# Altium schematic sheet TPS630250RNCT Buck-Boost Switching Regulator.SchDoc: +3.3 Output DC-DC Converter
size A4
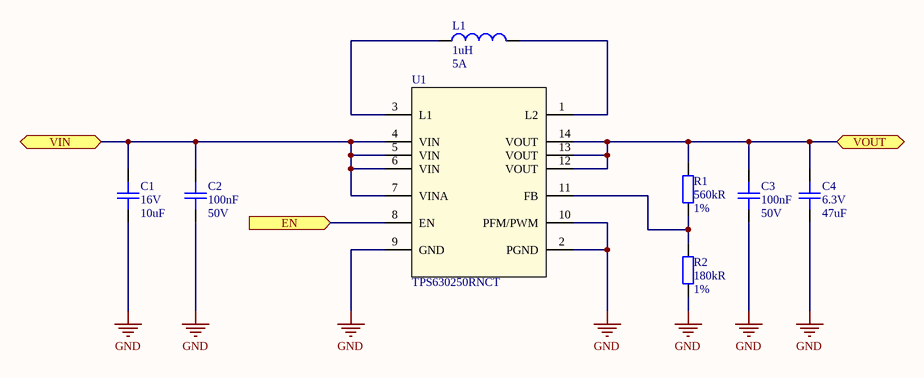
[diagram p0: TPS630250RNCT Buck-Boost Switching Regulator.SchDoc]

## Parts
C1  Voltage Rating: 16V  Capacitance: 10uF  [C0603]  (hidden comment: CAP CER 10UF 16V X5R 0603)
C2  Capacitance: 100nF  Voltage: 50V  [C0402]  (hidden comment: CAP CER 0.1UF 50V X7R 0402)
C3  Capacitance: 100nF  Voltage: 50V  [C0402]  (hidden comment: CAP CER 0.1UF 50V X7R 0402)
C4  Voltage Rating: 6.3V  Capacitance: 47uF  [C0603]  (hidden comment: CAP CER 47UF 6.3V X5R 0603)
L1  Inductance: 1uH  Current Rating: 5A  [IND_IHLP-1212B00]  (hidden comment: FIXED IND 1UH 5A 24 MOHM SMD)
R1  Resistance: 560kR  Tolerance: 1%  [R0402]  (hidden comment: RES SMD 560K OHM 1% 1/16W 0402)
R2  Resistance: 180kR  Tolerance: 1%  [R0402]  (hidden comment: RES SMD 180K OHM 1% 1/16W 0402)
U1  TPS630250RNCT  [VFQFN-14]

## Ports
EN (in), VIN, VOUT

## Nets
GND: C1.1 C2.1 C3.1 C4.1 R2.1 U1.2(PGND) U1.9(GND) U1.10(PFM/PWM)
EN: U1.8(EN) ; port EN
VIN: C1.2 C2.2 U1.4(VIN) U1.5(VIN) U1.6(VIN) U1.7(VINA) ; port VIN
VOUT: C3.2 C4.2 R1.2 U1.12(VOUT) U1.13(VOUT) U1.14(VOUT) ; port VOUT
NetL1_1: L1.1 U1.3(L1)
NetL1_2: L1.2 U1.1(L2)
NetR1_1: R1.1 R2.2 U1.11(FB)

## Notes on the sheet
- Title
- Size:
- Date:
- A4
- Number:
- Time:
- Revision:
- Sheet
- of
- File:

## Library data of the parts
C1 = CAP CER 10UF 16V X5R 0603: 10µF ±10% 16V Ceramic Capacitor X5R 0603 (1608 Metric); Manufacturer: Murata; Manufacturer Part Number: GRM188R61C106KAALJ; Supplier 1: Digi-Key; Stock 1: 5470; Pricing 1: 1=0.39, 10=0.271, 100=0.1628, 500=0.1221, 1000=0.1031, 2500=0.0977, 5000=0.0923 (USD); Mount: Surface Mount; Case Code (Imperial): 0603; Case Code (Metric): 1608; Min Operating Temperature: -55°C; Max Operating Temperature: 85°C; Voltage Rating (DC): 16V; Tolerance: 10%; Packaging: Tape and Reel; Package Quantity: 10000; Dielectric: X5R; Termination: SMD/SMT; Composition: Ceramic; Length: 0.063inch; Height: 0.8mm; Width: 0.031inch; Thickness: 0.037inch; Supplier Part Number 1: 490-12736-1-ND; Case/Package: 0603; Weight: 0.000222oz
C2 C3 = CAP CER 0.1UF 50V X7R 0402: 0.1µF ±10% 50V Ceramic Capacitor X7R 0402 (1005 Metric); Manufacturer: TDK; Manufacturer Part Number: CGA2B3X7R1H104K050BB; Supplier 1: Digi-Key; Stock 1: 2925303; Pricing 1: 1=0.17, 10=0.118, 50=0.0668, 100=0.0553, 500=0.0388, 1000=0.0321, 2500=0.0299, 5000=0.0273 (USD); Mount: Surface Mount; Case/Package: 0402; Weight: 2.3E-05oz; Case Code (Metric): 1005; Case Code (Imperial): 0402; Min Operating Temperature: -55°C; Max Operating Temperature: 125°C; Voltage Rating: 50V; Tolerance: 10%; Packaging: Tape and Reel; Package Quantity: 1; Voltage Rating (DC): 50V; Dielectric: X7R; Termination: SMD/SMT; Composition: Ceramic; Length: 1mm; Height: 0.5mm; Width: 0.02inch; Thickness: 0.022inch; Depth: 0.5mm; Ratings: AEC-Q200; REACH SVHC: No SVHC; Lead Free: Lead Free; ComponentLink1URL: http://product.tdk.com/capacitor/mlcc/en/documents/mlccspec_automotive_general_midvoltage_en.pdf?src-supplier=Future+Electronics; ComponentLink1Description: http://product.tdk.com/capacitor/mlcc/en/documents/mlccspec_automotive_general_midvoltage_en.pdf?src-supplier=Future+Electronics; ComponentLink2URL: http://www.farnell.com/datasheets/1807242.pdf?src-supplier=Element14; ComponentLink2Description: http://www.farnell.com/datasheets/1807242.pdf?src-supplier=Element14; ComponentLink3URL: http://www.mouser.com/ds/2/400/lcc_automotive_general_en-843974.pdf?src-supplier=Mouser; ComponentLink3Description: http://www.mouser.com/ds/2/400/lcc_automotive_general_en-843974.pdf?src-supplier=Mouser; ComponentLink4URL: http://www.farnell.com/datasheets/1936565.pdf?src-supplier=Element14; ComponentLink4Description: http://www.farnell.com/datasheets/1936565.pdf?src-supplier=Element14; ComponentLink5URL: http://www.farnell.com/datasheets/1735392.pdf?src-supplier=Element14; ComponentLink5Description: http://www.farnell.com/datasheets/1735392.pdf?src-supplier=Element14; Supplier Part Number 1: 445-6899-1-ND
C4 = CAP CER 47UF 6.3V X5R 0603: 47 µF ±20% 6.3V Ceramic Capacitor X5R 0603 (1608 Metric); Manufacturer: AVX Corporation; Manufacturer Part Number: 06036D476MAT2A; Supplier 1: Digi-Key; Stock 1: 325858; Pricing 1: 1=0.26, 10=0.18, 100=0.102, 500=0.072, 1000=0.063 (USD); Mount: Surface Mount; Case Code (Imperial): 0603; Case Code (Metric): 1608; Min Operating Temperature: -55°C; Max Operating Temperature: 85°C; Voltage Rating (DC): 6.3V; Tolerance: 20%; Packaging: Tape and Reel; Package Quantity: 1; Dielectric: X5R; Termination: SMD/SMT; Composition: Ceramic; Length: 1.6mm; Height: 0.8mm; Width: 0.8mm; Thickness: 0.035inch; Depth: 0.8mm; Radiation Hardening: No; REACH SVHC: Unknown; Lead Free: Lead Free; Halogen Free: Halogen Free; ComponentLink1URL: https://www.digikey.com/en/products/detail/avx-corporation/06036D476MAT2A/7563129?s=N4IgTCBcDaIAwDY4GYEBEAsB2BBZAggCpj4gC6AvkA; ComponentLink1Description: https://www.digikey.com/en/products/detail/avx-corporation/06036D476MAT2A/7563129?s=N4IgTCBcDaIAwDY4GYEBEAsB2BBZAggCpj4gC6AvkA; Supplier Part Number 1: 478-11180-1-ND; Case/Package: 0603
L1 = FIXED IND 1UH 5A 24 MOHM SMD: 1µH Shielded Molded Inductor 5A 24mOhm Max Nonstandard; Manufacturer: Vishay Dale; Manufacturer Part Number: IHLP1212BZER1R0M11; Core Material: Metal,Composite; Tolerance: 20%; DC Resistance (DCR): 24mR; Self Resonant Frequency: 75MHz; Saturation Current: 4.5A; Test Frequency: 100kHz; Supplier 1: Digi-Key; Stock 1: 70286; Pricing 1: 1=1.39, 10=1.287, 25=1.188, 50=0.99, 100=0.9306, 250=0.8316, 500=0.7128, 1000=0.6336 (USD); Mount: Surface Mount; Case/Package: 1212; Number of Pins: 2; Case Code (Metric): 3630; Case Code (Imperial): 1212; Contact Plating: Tin; Min Operating Temperature: -55°C; Max Operating Temperature: 125°C; Shielding: Shielded; Packaging: Tape and Reel; Package Quantity: 3000; Inductance Tolerance: 20%; Max DC Current: 5A; Termination: SMD/SMT; RMS Current (Irms): 5A; Military Standard: Not; Length: 3.6mm; Height: 2mm; Depth: 3.2mm; Width: 0.118inch; Height - Seated (Max): 0.079inch; Radiation Hardening: No; REACH SVHC: Unknown; Lead Free: Lead Free; ComponentLink1URL: http://www.mouser.com/ds/2/427/lp12bz11-244380.pdf?src-supplier=Mouser; ComponentLink1Description: http://www.mouser.com/ds/2/427/lp12bz11-244380.pdf?src-supplier=Mouser; ComponentLink2URL: http://www.vishay.com/docs/34289/lp12bz11.pdf?src-supplier=Digi-Key; ComponentLink2Description: http://www.vishay.com/docs/34289/lp12bz11.pdf?src-supplier=Digi-Key; ComponentLink3URL: http://www.vishay.com/docs/34289/lp12bz11.pdf?src-supplier=Avnet; ComponentLink3Description: http://www.vishay.com/docs/34289/lp12bz11.pdf?src-supplier=Avnet; ComponentLink4URL: http://www.farnell.com/datasheets/652599.pdf?src-supplier=Element14; ComponentLink4Description: http://www.farnell.com/datasheets/652599.pdf?src-supplier=Element14; ComponentLink5URL: http://www.vishay.com/docs/34289/lp12bz11.pdf?src-supplier=Avnet+Europe; ComponentLink5Description: http://www.vishay.com/docs/34289/lp12bz11.pdf?src-supplier=Avnet+Europe; ComponentLink6URL: https://www.verical.com/server-webapp/html/getDatasheet?partID=180380&src-supplier=Verical; ComponentLink6Description: https://www.verical.com/server-webapp/html/getDatasheet?partID=180380&src-supplier=Verical; Supplier Part Number 1: 541-1319-1-ND
R1 = RES SMD 560K OHM 1% 1/16W 0402: 560 kOhms ±1% 0.063W, 1/16W Chip Resistor 0402 (1005 Metric) Moisture Resistant Thick Film; Manufacturer: Yageo; Manufacturer Part Number: RC0402FR-07560KL; Power Rating: 62.5mW; Voltage Rating: 50V; Temperature Coefficient: 100ppm/°C; Max Power Dissipation: 63mW; Supplier 1: Digi-Key; Stock 1: 16630; Pricing 1: 1=0.1, 10=0.015, 100=0.0062, 1000=0.0028, 2500=0.0024, 5000=0.002 (USD); Case/Package: 0402; Case Code (Imperial): 0402; Case Code (Metric): 1005; Min Operating Temperature: -55°C; Max Operating Temperature: 155°C; Packaging: Tape and Reel; Termination: SMD/SMT; Composition: Thick Film; Number of Terminations: 2; Military Standard: Not; Features: Moisture Resistant; Length: 1mm; Height: 0.016inch; Depth: 0.5mm; Width: 0.02inch; Lead Free: Lead Free; ComponentLink1URL: https://www.digikey.com/en/products/detail/yageo/RC0402FR-07560KL/726637?s=N4IgTCBcDaIEoGEAMAWJYBicC0SDsArAGxIDSAMiALoC%2BQA; ComponentLink1Description: https://www.digikey.com/en/products/detail/yageo/RC0402FR-07560KL/726637?s=N4IgTCBcDaIEoGEAMAWJYBicC0SDsArAGxIDSAMiALoC%2BQA; Supplier Part Number 1: 311-560KLRTR-ND; Contact Plating: Tin,Matte; Mount: Surface Mount
R2 = RES SMD 180K OHM 1% 1/16W 0402: 180 kOhms ±1% 0.063W, 1/16W Chip Resistor 0402 (1005 Metric) Moisture Resistant Thick Film; Manufacturer: Yageo; Manufacturer Part Number: RC0402FR-07180KL; Power Rating: 62.5mW; Voltage Rating: 50V; Temperature Coefficient: 100ppm/°C; Max Power Dissipation: 63mW; Supplier 1: Digi-Key; Stock 1: 16630; Pricing 1: 1=0.1, 10=0.015, 100=0.0062, 1000=0.0028, 2500=0.0024, 5000=0.002 (USD); Case/Package: 0402; Case Code (Imperial): 0402; Case Code (Metric): 1005; Min Operating Temperature: -55°C; Max Operating Temperature: 155°C; Packaging: Tape and Reel; Termination: SMD/SMT; Composition: Thick Film; Number of Terminations: 2; Military Standard: Not; Features: Moisture Resistant; Length: 1mm; Height: 0.016inch; Depth: 0.5mm; Width: 0.02inch; Lead Free: Lead Free; ComponentLink1URL: https://www.digikey.com/en/products/detail/yageo/RC0402FR-07180KL/726549?s=N4IgTCBcDaIEoGEAMAWJYBicC0SDsAjABxIDSAMiALoC%2BQA; ComponentLink1Description: https://www.digikey.com/en/products/detail/yageo/RC0402FR-07180KL/726549?s=N4IgTCBcDaIEoGEAMAWJYBicC0SDsAjABxIDSAMiALoC%2BQA; Supplier Part Number 1: 311-180KLRTR-ND; Contact Plating: Tin,Matte; Mount: Surface Mount
U1 = IC TPS630250RNCT REG BCK BST ADJ 2A/4A 14VQFN: Buck-Boost Switching Regulator IC Positive Adjustable 2.3V 1 Output 2A, 4A 14-VFQFN; Manufacturer: Texas Instruments; ComponentLink1URL: https://www.digikey.be/product-detail/en/texas-instruments/TPS630250RNCT/296-42036-2-ND/5226740; ComponentLink1Description: https://www.digikey.be/product-detail/en/texas-instruments/TPS630250RNCT/296-42036-2-ND/5226740; Supplier 1: Digi-Key; Manufacturer Part Number: TPS630250RNCT; Stock 1: 2595; Pricing 1: 1=2.81, 10=2.523, 25=2.3848, 100=1.961, 250=1.7596, 500=1.696, 1000=1.4098 (USD); Supplier Part Number 1: 296-42036-2-ND